# Altium schematic sheet INA381A SEL Protection - 2.SchDoc: LT4363-2 SEL Protection
size Letter; SheetNumber: 13; SheetTotal: 18
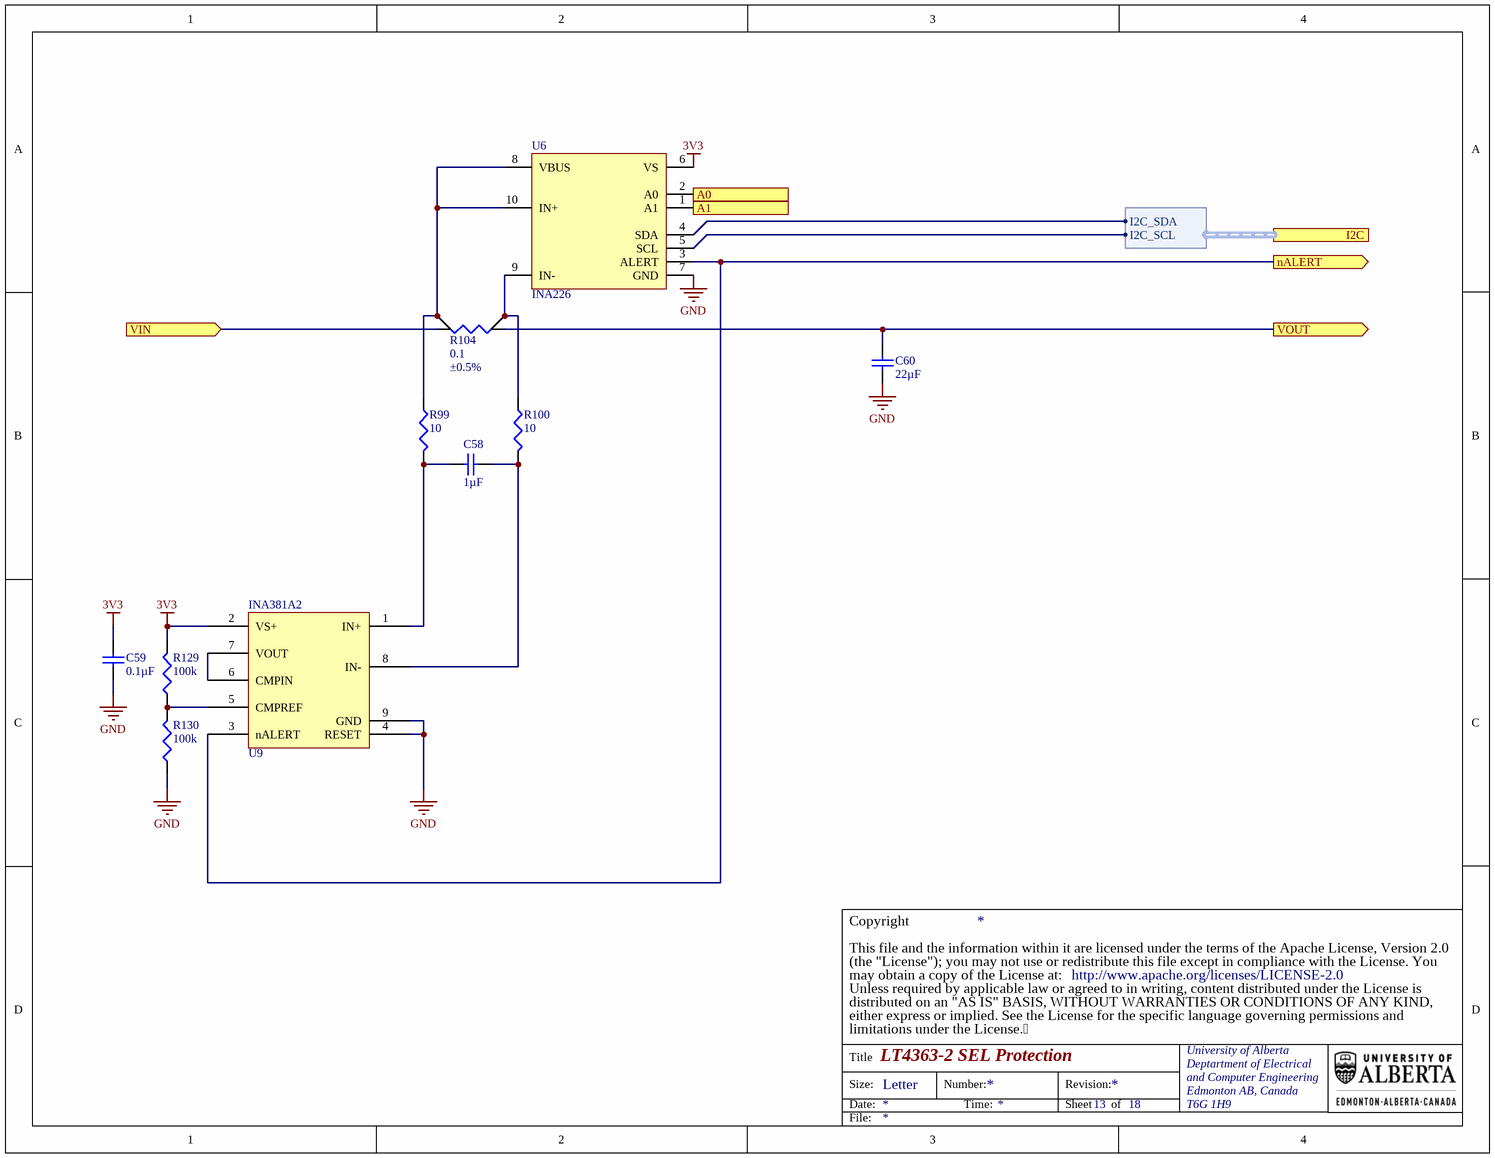
[diagram p0: INA381A SEL Protection - 2.SchDoc]

## Parts
C58  value 1µF  [TY-0402D]  (hidden comment: Cap)
C59  value 0.1µF  [TDK-CGA2B]  (hidden comment: Cap)
C60  value 22µF  [TY-1206L]  (hidden comment: Cap)
R99  value 10  [PANA-ERA2A]  (hidden comment: Res3)
R100  value 10  [PANA-ERA2A]  (hidden comment: Res3)
R104  value 0.1  Tolerance: ±0.5%  [VSH-WSL0805]  (hidden comment: Res Sense)
R129  value 100k  [PANA-ERJ2R]  (hidden comment: Res3)
R130  value 100k  [PANA-ERJ2R]  (hidden comment: Res3)
U6  INA226  [TI-DGS]
U9  INA381A2  [TI-DSG0008A]

## Ports
A0 (in), A1 (in), I2C (harness INA226_I2C), nALERT (out), VIN (in), VOUT (out)

## Harnesses
INA226_I2C: I2C_SCL, I2C_SDA

## Nets
3V3: C59.2 R129.2 U6.6(VS) U9.2(VS+)
GND: C59.1 C60.1 R130.1 U6.7(GND) U9.4(RESET) U9.9(GND)
A0: U6.2(A0) ; port A0
A1: U6.1(A1) ; port A1
nALERT: U6.3(ALERT) U9.3(nALERT) ; port nALERT
VIN: R104.1(I1) ; port VIN
VOUT: C60.2 R104.2(I2) ; port VOUT
NetC58_1: C58.1 R99.2 U9.1(IN+)
NetC58_2: C58.2 R100.2 U9.8(IN-)
NetR99_1: R99.1 R104.4(S1) U6.8(VBUS) U6.10(IN+)
NetR100_1: R100.1 R104.3(S2) U6.9(IN-)
NetR129_1: R129.1 R130.2 U9.5(CMPREF)
NetU6_4: U6.4(SDA) ; port I2C.I2C_SDA
NetU6_5: U6.5(SCL) ; port I2C.I2C_SCL
NetU9_6: U9.6(CMPIN) U9.7(VOUT)

## Notes on the sheet
- (the "License"); you may not use or redistribute this file except in compliance with the License. You
- This file and the information within it are licensed under the terms of the Apache License, Version 2.0
- Copyright
- Unless required by applicable law or agreed to in writing, content distributed under the License is
- distributed on an "AS IS" BASIS, WITHOUT WARRANTIES OR CONDITIONS OF ANY KIND,
- either express or implied. See the License for the specific language governing permissions and
- limitations under the License.
- may obtain a copy of the License at:
- http://www.apache.org/licenses/LICENSE-2.0
- Title
- Size:
- Date:
- Letter
- Number:
- Time:
- Revision:
- Sheet
- of
- University of Alberta
- Deptartment of Electrical
- and Computer Engineering
- Edmonton AB, Canada
- T6G 1H9
- File:

## Library data of the parts
C58 = PC-TY-00806: CAP CER 1UF 25V X5R 0402; Manufacturer Part Number: GRT155R61E105KE01D; Index: 806; Designator: C?; Tolerance: ±10%; Published: 2019-07-31; LatestRevisionDate: 2019-07-31; LatestRevisionNote: ...; PackageReference: 0402 (1005 Metric); Publisher: AlbertaSat; PackageDescription: Chip Capacitor, 2-Leads, Body 1.00x0.50mm, IPC Low Density; Part Number: PC-TY-00806; Supplier Part Number 1: 490-12263-1-ND; Supplier 1: Digi-key; Supplier Part Number 2: 81-GRT155R61E105KE1D; Supplier 2: Mouser; Supplier Link: #https://www.digikey.ca/products/en?keywords=490-12263-1-ND#; Voltage-Rated: 25V; Temperature Coefficient: X5R; Application: Automotive
C59 = PC-TDK-02259: CAP CER 0.1UF 50V X7R 0402; Manufacturer Part Number: CGA2B3X7R1H104K050BB; Index: 2259; Designator: C?; Tolerance: ±10%; Published: 2016-03-16; LatestRevisionDate: 2016-03-16; LatestRevisionNote: ...; PackageReference: 0402 (1005 Metric); Publisher: AlbertaSat; PackageDescription: Radial Cap, Thru-Hole; 2 Leads; 0.3 in Pin Spacing; Part Number: PC-TDK-02259; Supplier Part Number 1: 445-6899-1-ND; Supplier 1: Digi-key; Supplier Link: http://www.digikey.ca/product-search/en?keywords=445-6899-1-ND; Voltage - Rated: 50V; Temperature Coefficient: X7R; Applications: Automotive
C60 = PC-TY-00721: CAP CER 22UF 16V X7R 1206; Manufacturer Part Number: EMK316BB7226ML-T; Index: 721; Designator: C?; Tolerance: ±20%; Published: 3/13/2016; LatestRevisionDate: 3/13/2016; LatestRevisionNote: ...; PackageReference: 1206 (3216 Metric); Publisher: AlbertaSat; PackageDescription: Chip Capacitor, 2-Leads, Body 3.20x1.60mm, IPC Low Density; Part Number: PC-TY-00721; Supplier Part Number 1: 587-4319-1-ND; Supplier 1: Digi-key; Supplier Link: http://www.digikey.ca/product-search/en?keywords=587-4319-1-ND; Voltage-Rated: 16V; Temperature Coefficient: X7R; Application: General Purpose
R99 R100 = 13235: RES SMD 10 OHM 0.5% 1/16W 0402; Part Number: 13235; Manufacturer Part Number: ERA-2AKD100X; Designator: R?; Power: 0.063W, 1/16W; Temperature Coefficient: ±100ppm/°C; Published: 8-Jun-2000; LatestRevisionDate: 29-May-2009; LatestRevisionNote: IPC-7351 Footprint Added.; PackageReference: 0402 (1005 Metric); Publisher: Altium Limited; PackageDescription: Chip Resistor, 2-Leads, Body 1.00x0.50mm, IPC Low Density; Supplier Part Number 1: P10DDCT-ND; Supplier 1: Digi-Key; Supplier Link: http://www.digikey.ca/product-search/en?keywords=P10DDCT-ND; Tolerance: ±0.5%
R104 = PR-VSH-00315: RES 0.1 OHM 0.5% 1/4W 0805; Manufacturer Part Number: WSL0805R1000DEA18-ND; Power - Rated: 0.25W, 1/4W; Index: 315; Designator: R?; Temperature Coefficient: ±75ppm/°C; Part Number: PR-VSH-00315; Supplier Part Number 1: WSL0805R1000DEA18-ND; Supplier 1: Digi-key; Publisher: AlbertaSat; Published: 2019-08-08; LatestRevisionDate: 2019-08-08; LatestRevisionNote: ...; PackageReference: 0805 (2012 Metric); PackageDescription: 0805 (2012 Metric); Supplier Link: #https://www.digikey.ca/products/en?keywords=WSL0805R1000DEA18-ND#
R129 R130 = 18739: RES SMD 100K OHM 1% 1/10W 0402; Part Number: 18739; Manufacturer Part Number: ERJ-2RKF1003X; Designator: R?; Power: 0.1W, 1/10W; Temperature Coefficient: ±100ppm/°C; Published: 8-Jun-2000; LatestRevisionDate: 29-May-2009; LatestRevisionNote: IPC-7351 Footprint Added.; PackageReference: 0402 (1005 Metric); Publisher: Altium Limited; PackageDescription: Chip Resistor, 2-Leads, Body 1.00x0.50mm, IPC Low Density; Supplier Part Number 1: P100KLCT-ND; Supplier 1: Digi-Key; Supplier Link: http://www.digikey.ca/product-search/en?keywords=P100KLCT-ND; Tolerance: ±1%
U6 = 19: IC MONITOR PWR/CURR BIDIR 10MSOP; Part Number: 19; Manufacturer Part Number: INA226AQDGSRQ1; Designator: U?; Supplier Part Number 2: 595-INA226AQDGSRQ1; Supplier 2: Mouser; Supplier Part Number 1: 296-42503-1-ND; Supplier 1: Digi-Key; Supplier Link: https://www.digikey.com/product-detail/en/texas-instruments/INA226AQDGSRQ1/296-42503-1-ND/5416001; PackageReference: TI-MSOP10
U9 = 110: CURRENT SENSE AMPLIFIER WITH INT; Part Number: 110; Manufacturer Part Number: INA381A2IDSGT; Designator: U?; Supplier Part Number 2: 595-INA381A2IDSGT; Supplier 2: Mouser; Supplier Part Number 1: 296-49078-1-ND; Supplier 1: Digi-Key; Supplier Link: #https://www.digikey.ca/product-detail/en/texas-instruments/INA381A2IDSGT/296-49078-1-ND/9091891#; PackageReference: 8-WFDFN Exposed Pad